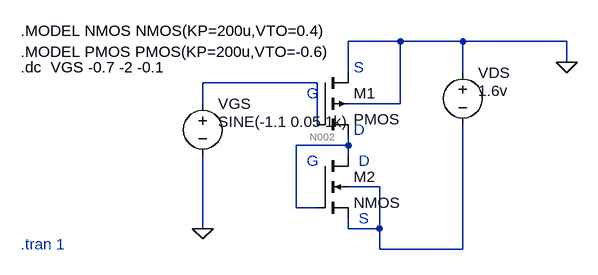
[diagram p0: schematic PMOS-NMOS.asc]
PMOS-NMOS.asc, the LTspice schematic file:
Version 4
SHEET 1 880 680
WIRE 256 -16 176 -16
WIRE 352 -16 256 -16
WIRE 512 -16 352 -16
WIRE 512 16 512 -16
WIRE 176 32 176 -16
WIRE 352 32 352 -16
WIRE 128 48 -48 48
WIRE -48 80 -48 48
WIRE 256 80 256 -16
WIRE 256 80 176 80
WIRE 128 112 128 48
WIRE 176 144 176 128
WIRE 176 144 96 144
WIRE 176 160 176 144
WIRE 224 208 176 208
WIRE 96 240 96 144
WIRE 128 240 96 240
WIRE -48 272 -48 160
WIRE 176 272 176 256
WIRE 224 272 224 208
WIRE 224 272 176 272
WIRE 224 304 224 272
WIRE 352 304 352 112
WIRE 352 304 224 304
FLAG -48 272 0
FLAG 512 16 0
SYMBOL voltage 352 16 R0
WINDOW 123 0 0 Left 0
WINDOW 39 0 0 Left 0
WINDOW 3 24 44 Left 2
SYMATTR Value 1.6v
SYMATTR InstName VDS
SYMBOL voltage -48 64 R0
WINDOW 123 0 0 Left 0
WINDOW 39 0 0 Left 0
WINDOW 3 24 44 Left 2
SYMATTR Value SINE(-1.1 0.05 1k)
SYMATTR InstName VGS
SYMBOL pmos4 128 32 R0
SYMATTR InstName M1
SYMATTR Value2 l=1u w=10u
SYMBOL nmos4 128 160 R0
SYMATTR InstName M2
SYMATTR Value2 l=1u w=10u
TEXT 184 120 Left 2 ;D
TEXT 112 64 Left 2 ;G
TEXT 184 24 Left 2 ;S
TEXT -328 0 Left 2 !.MODEL PMOS PMOS(KP=200u,VTO=-0.6)
TEXT -328 24 Left 2 !.dc  VGS -0.7 -2 -0.1
TEXT -328 296 Left 2 ;.tran 1
TEXT 192 256 Left 2 ;S
TEXT 192 168 Left 2 ;D
TEXT 112 168 Left 2 ;G
TEXT -328 -32 Left 2 !.MODEL NMOS NMOS(KP=200u,VTO=0.4)

The netlist it stands for:
* PMOS-NMOS.asc
VDS 0 N003 1.6v
VGS N001 0 SINE(-1.1 0.05 1k)
M1 0 N001 N002 0 PMOS l=1u w=10u
M2 N002 N002 N003 N003 NMOS l=1u w=10u
.model NMOS NMOS
.model PMOS PMOS
.lib standard.mos
* D
* G
* S
.MODEL PMOS PMOS(KP=200u,VTO=-0.6)
.dc  VGS -0.7 -2 -0.1
* .tran 1
* S
* D
* G
.MODEL NMOS NMOS(KP=200u,VTO=0.4)
.backanno
.end

* Results of the author's LTspice run, read from the files saved beside the schematic
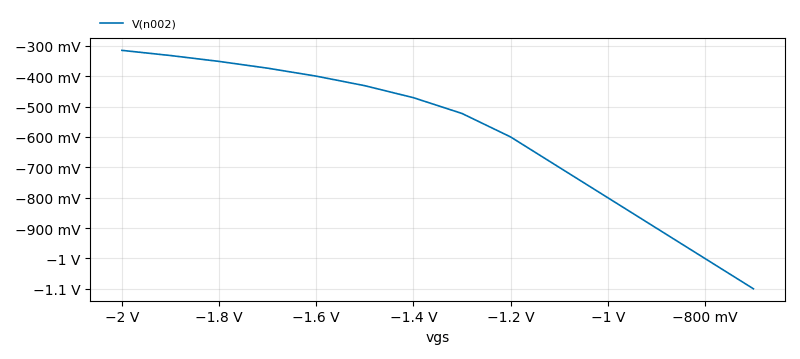
[diagram p1: DC transfer characteristic of PMOS-NMOS.asc, plotted from the saved traces]
* DC transfer characteristic, 1 run:
*   V(n002): -1.1 V at vgs=-700 mV, -315.1 mV at vgs=-2 V, min -1.1 V, max -315.1 mV